# EAGLE design pmod-eight-led (EAGLE 7.7.0)
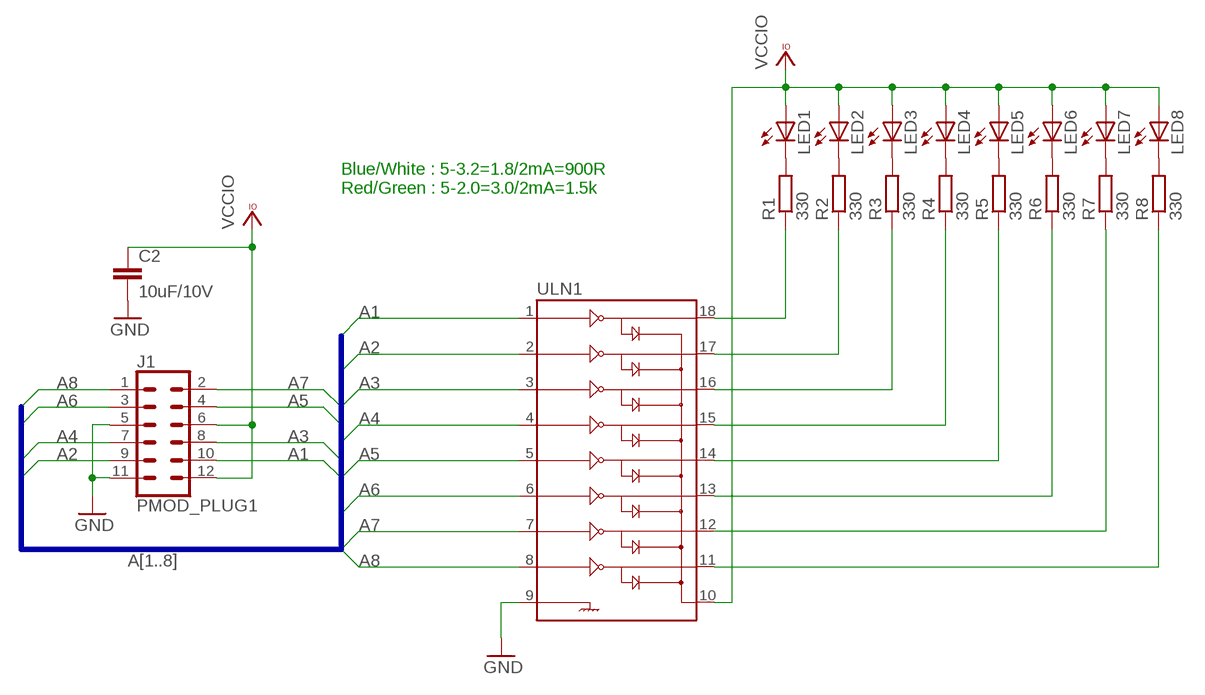
[diagram p0: schematic, sheet 1]

## Parts
C2  10uF/10V  C-EUC0805K  [C0805K]
J1  PMOD_PLUG1  CONN_06X2SMD_RA_PLUG  [2X6_SMD_RA_PLUG]
LED1  LED0603  [LED-603]
LED2  LED0603  [LED-603]
LED3  LED0603  [LED-603]
LED4  LED0603  [LED-603]
LED5  LED0603  [LED-603]
LED6  LED0603  [LED-603]
LED7  LED0603  [LED-603]
LED8  LED0603  [LED-603]
R1  330  R-EU_R0805W  [R0805W]
R2  330  R-EU_R0805W  [R0805W]
R3  330  R-EU_R0805W  [R0805W]
R4  330  R-EU_R0805W  [R0805W]
R5  330  R-EU_R0805W  [R0805W]
R6  330  R-EU_R0805W  [R0805W]
R7  330  R-EU_R0805W  [R0805W]
R8  330  R-EU_R0805W  [R0805W]
ULN1  ULN2803SOICW  [SO18L]

## Nets
A1: J1.10 ULN1.1
A2: J1.9 ULN1.2
A3: J1.8 ULN1.3
A4: J1.7 ULN1.4
A5: J1.4 ULN1.5
A6: J1.3 ULN1.6
A7: J1.2 ULN1.7
A8: J1.1 ULN1.8
GND: C2.2 J1.5 J1.11 ULN1.9
LED1: R1.1 ULN1.18
LED2: R2.1 ULN1.17
LED3: R3.1 ULN1.16
LED4: R4.1 ULN1.15
LED5: R5.1 ULN1.14
LED6: R6.1 ULN1.13
LED7: R7.1 ULN1.12
LED8: R8.1 ULN1.11
N$1: LED1.C R1.2
N$2: LED2.C R2.2
N$3: LED3.C R3.2
N$4: LED4.C R4.2
N$5: LED5.C R5.2
N$6: LED6.C R6.2
N$7: LED7.C R7.2
N$8: LED8.C R8.2
VCCIO: C2.1 J1.6 J1.12 LED1.A LED2.A LED3.A LED4.A LED5.A LED6.A LED7.A LED8.A ULN1.10

## Buses
A[1..8]

## Notes on the sheet
- Blue/White : 5-3.2=1.8/2mA=900R
  Red/Green : 5-2.0=3.0/2mA=1.5k

## Library data of the parts
C2 = rcl:C-EU: CAPACITOR, European symbol; SPICEPREFIX: C
J1 = mechanical:CONN_06X2: Multi connection point. Often used as Generic Header-pin footprint for 0.1 inch spaced/style header connections On any of the 0.1 inch spaced packages, you can populate with these: Break Away Headers - Straight <https://www.sparkfun.com/products/116> (PRT-00116) Break Away Male Headers - Right Angle <https://www.sparkfun.com/products/553> (PRT-00553) Female Headers <https://www.sparkfun.com/products/115> (PRT-00115) Break Away Headers - Machine Pin <https://www.sparkfun.com/products/117> (PRT-00117) Break Away Female Headers - Swiss Machine Pin <https://www.sparkfun.com/products/743> (PRT-00743)
LED1-LED8 = semiconductors:LED: Light Emitting Diode
R1-R8 = rcl:R-EU_: RESISTOR, European symbol
ULN1 = SparkFun-IC-Special-Function:ULN2803: Darlington Driver(IC-07959, low stock) ULN2803 Darlington array. 500mA max per channel, 8-channel package. Spark Fun Electronics SKU : COM-00312

## Board
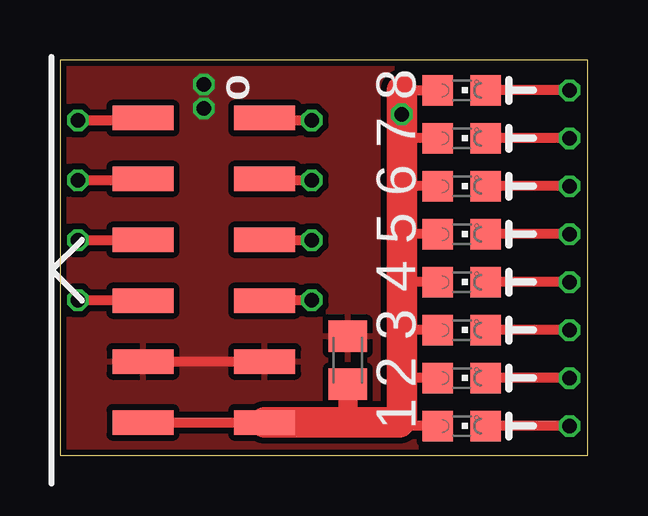
[diagram p1: board, top side]
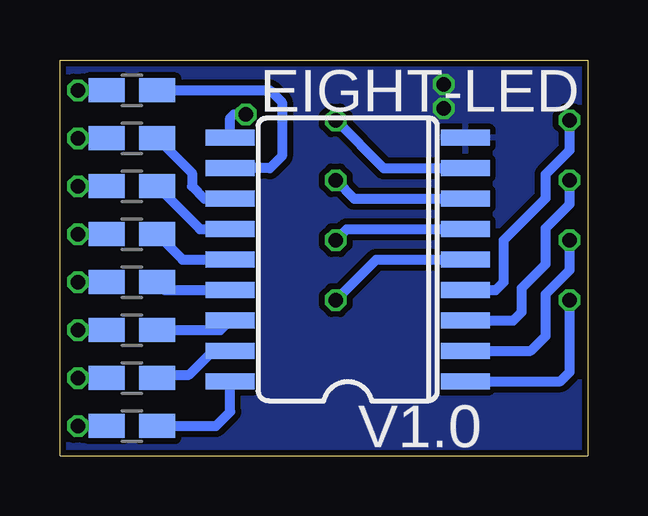
[diagram p2: board, bottom side, seen from below]

Size 22 x 16.5 mm. Coordinates in mm from the lower left corner, seen from the top.
Outline: 22,0 22,16.5 0,16.5 0,0 22,0
Copper layers (1*16): Top 0.035mm / dielectric 1.5mm / Bottom 0.035mm
Design rules "dirt_cheap_dirty_boards.v1.1": minimum track width 5mil, minimum drill 12mil, track to track 5mil, track to pad 5mil, pad to pad 5mil, via to via 5mil, smd to smd 0mil, copper to edge 10mil, drill to drill 10mil, minimum pad ring 10mil, minimum via ring 6mil, stop-mask expansion 2mil, vias tented up to drill 25mil, thermal gap 10mil

### Footprints (pad centres in the part's own frame; a part is rotated, then mirrored left to right if it is on the bottom)
C0805K = smd 1.3 x 1.6: 1 -1,0; 2 1,0
2X6_SMD_RA_PLUG = smd 1.016 x 2.54: 1 -6.35,2.54; 2 -3.81,2.54; 3 -1.27,2.54; 4 1.27,2.54; 5 3.81,2.54; 6 6.35,2.54; 7 -6.35,-2.54; 8 -3.81,-2.54; 9 -1.27,-2.54; 10 1.27,-2.54; 11 3.81,-2.54; 12 6.35,-2.54
LED-603 = smd 1.27 x 1.27: A 0,-1; C 0,1
R0805W = smd 1.5 x 1: 1 -1.052,0; 2 1.052,0
SO18L = smd 0.66 x 2.032: 1 -0.635,-4.902; 2 0.635,-4.902; 3 1.905,-4.902; 4 3.175,-4.902; 5 4.445,-4.902; 6 5.715,-4.902; 7 6.985,-4.902; 8 8.255,-4.902; 9 9.525,-4.902; 10 9.525,4.902; 11 8.255,4.902; 12 6.985,4.902; 13 5.715,4.902; 14 4.445,4.902; 15 3.175,4.902; 16 1.905,4.902; 17 0.635,4.902; 18 -0.635,4.902

### Placement (x,y rotation side)
C2  12,4 90 top
J1  6,7.75 270 top
LED1  16.75,1.25 270 top
LED2  16.75,3.25 270 top
LED3  16.75,5.25 270 top
LED4  16.75,7.25 270 top
LED5  16.75,9.25 270 top
LED6  16.75,11.25 270 top
LED7  16.75,13.25 270 top
LED8  16.75,15.25 270 top
R1  19,1.25 180 bottom
R2  19,3.25 180 bottom
R3  19,5.25 180 bottom
R4  19,7.25 180 bottom
R5  19,9.25 180 bottom
R6  19,11.25 180 bottom
R7  19,13.25 180 bottom
R8  19,15.25 180 bottom
ULN1  10,3.75 90 bottom

### Tracks (layer width: path | path; a pad name or v marks a point on that pad's centre or on a via)
A1  (via drill 0.6)
  Top 0.406: v0.75,6.5 3.44,6.5 J1.10
  Bottom 0.406: ULN1.1 1.14,3.12 0.75,3.5 v0.75,6.5
A2  (via drill 0.6)
  Top 0.406: v0.75,9 3.44,9 J1.9
  Bottom 0.406: ULN1.2 2.37,4.38 1.75,5 1.75,6.75 0.75,7.75 v0.75,9
A3  (via drill 0.6)
  Top 0.406: v0.75,11.5 3.4,11.5 J1.8
  Bottom 0.406: ULN1.3 3.1,5.66 2.75,6 2.75,7 1.75,8 1.75,9.5 0.75,10.5 v0.75,11.5
A4  (via drill 0.6)
  Top 0.406: v0.75,14 3.36,14 J1.7
  Bottom 0.406: ULN1.4 3.83,6.92 3.5,7.25 3.5,9 1.75,10.75 1.75,11.75 0.75,12.75 v0.75,14
A5  (via drill 0.6)
  Top 0.406: J1.4 8.5,6.52 8.52,6.5 v10.5,6.5
  Bottom 0.406: v10.5,6.5 8.8,8.2 ULN1.5
A6  (via drill 0.6)
  Top 0.406: J1.3 8.56,9 v10.5,9
  Bottom 0.406: v10.5,9 10.04,9.46 ULN1.6
A7  (via drill 0.6)
  Top 0.406: J1.2 8.6,11.5 v10.5,11.5
  Bottom 0.406: v10.5,11.5 9.73,10.73 ULN1.7
A8  (via drill 0.6)
  Top 0.406: J1.1 8.64,14 v10.5,14
  Bottom 0.406: v10.5,14 8.51,12.01 ULN1.8
GND  (via drill 0.6)
  Top 0.406: J1.11 J1.5
  other vias: 6,14.5 6,15.5
  pour Top (isolate 0.254): 0,16.75 22,16.75 22,0 0,0
  pour Bottom (isolate 0.254): 0,16.75 22,16.75 22,0 0,0
LED1
  Bottom 0.406: R1.1 15.5,1.25 14.9,1.85 ULN1.18
LED2
  Bottom 0.406: R2.1 17.81,3.38 16.61,3.38 15.75,4.25 15.04,4.25 ULN1.17
LED3
  Bottom 0.406: R3.1 15.31,5.25 ULN1.16
LED4
  Bottom 0.406: R4.1 17.62,6.92 ULN1.15
LED5
  Bottom 0.406: R5.1 16.89,8.2 ULN1.14
LED6
  Bottom 0.406: R6.1 16.16,9.46 ULN1.13
LED7
  Bottom 0.406: R7.1 16.5,11.8 16.5,11.25 15.98,10.73 ULN1.12
LED8
  Bottom 0.406: R8.1 13.25,15.25 12.75,14.75 12.75,12.5 13.24,12.01 ULN1.11
N$1  (via drill 0.6)
  Top 0.406: v21.25,1.25 LED1.C
  Bottom 0.406: R1.2 v21.25,1.25
N$2  (via drill 0.6)
  Top 0.406: v21.25,3.25 LED2.C
  Bottom 0.406: R2.2 v21.25,3.25
N$3  (via drill 0.6)
  Top 0.406: v21.25,5.25 LED3.C
  Bottom 0.406: R3.2 v21.25,5.25
N$4  (via drill 0.6)
  Top 0.406: v21.25,7.25 LED4.C
  Bottom 0.406: R4.2 v21.25,7.25
N$5  (via drill 0.6)
  Top 0.406: v21.25,9.25 LED5.C
  Bottom 0.406: R5.2 v21.25,9.25
N$6  (via drill 0.6)
  Top 0.406: v21.25,11.25 LED6.C
  Bottom 0.406: R6.2 v21.25,11.25
N$7  (via drill 0.6)
  Top 0.406: v21.25,13.25 LED7.C
  Bottom 0.406: R7.2 v21.25,13.25
N$8  (via drill 0.6)
  Top 0.406: v21.25,15.25 LED8.C
  Bottom 0.406: R8.2 v21.25,15.25
VCCIO  (via drill 0.6)
  Top 0.406: J1.12 J1.6 | 14.25,15.25 LED8.A | LED7.A 14.25,13.25 | LED6.A 14.25,11.25 | LED5.A 14.25,9.25 | LED4.A 14.25,7.25 | LED3.A 14.5,5.25 14.25,5.5 | LED2.A 14.5,3.25 14.25,3.5 | LED1.A 14.5,1.25 14.25,1.5 | 12,1.65 11.75,1.4
  Top 0.813: C2.1 12,1.65
  Top 1.27: 14.25,15.25 v14.25,14.25 14.25,13.75 14.25,13.25 14.25,11.25 14.25,9.25 14.25,7.25 14.25,5.5 14.25,3.5 14.25,1.5 14.15,1.4 11.75,1.4 J1.6
  Bottom 0.406: ULN1.10 14.9,14.1 14.75,14.25 v14.25,14.25

### Text on the board
tPlace: 8 | 7 | 6 | 5 | 4 | 3 | 2 | 1
bPlace: EIGHT-LED | V1.0